# EAGLE schematic snc98_main_cpu (EAGLE 7.7.0)

## Sheet 1 of 3
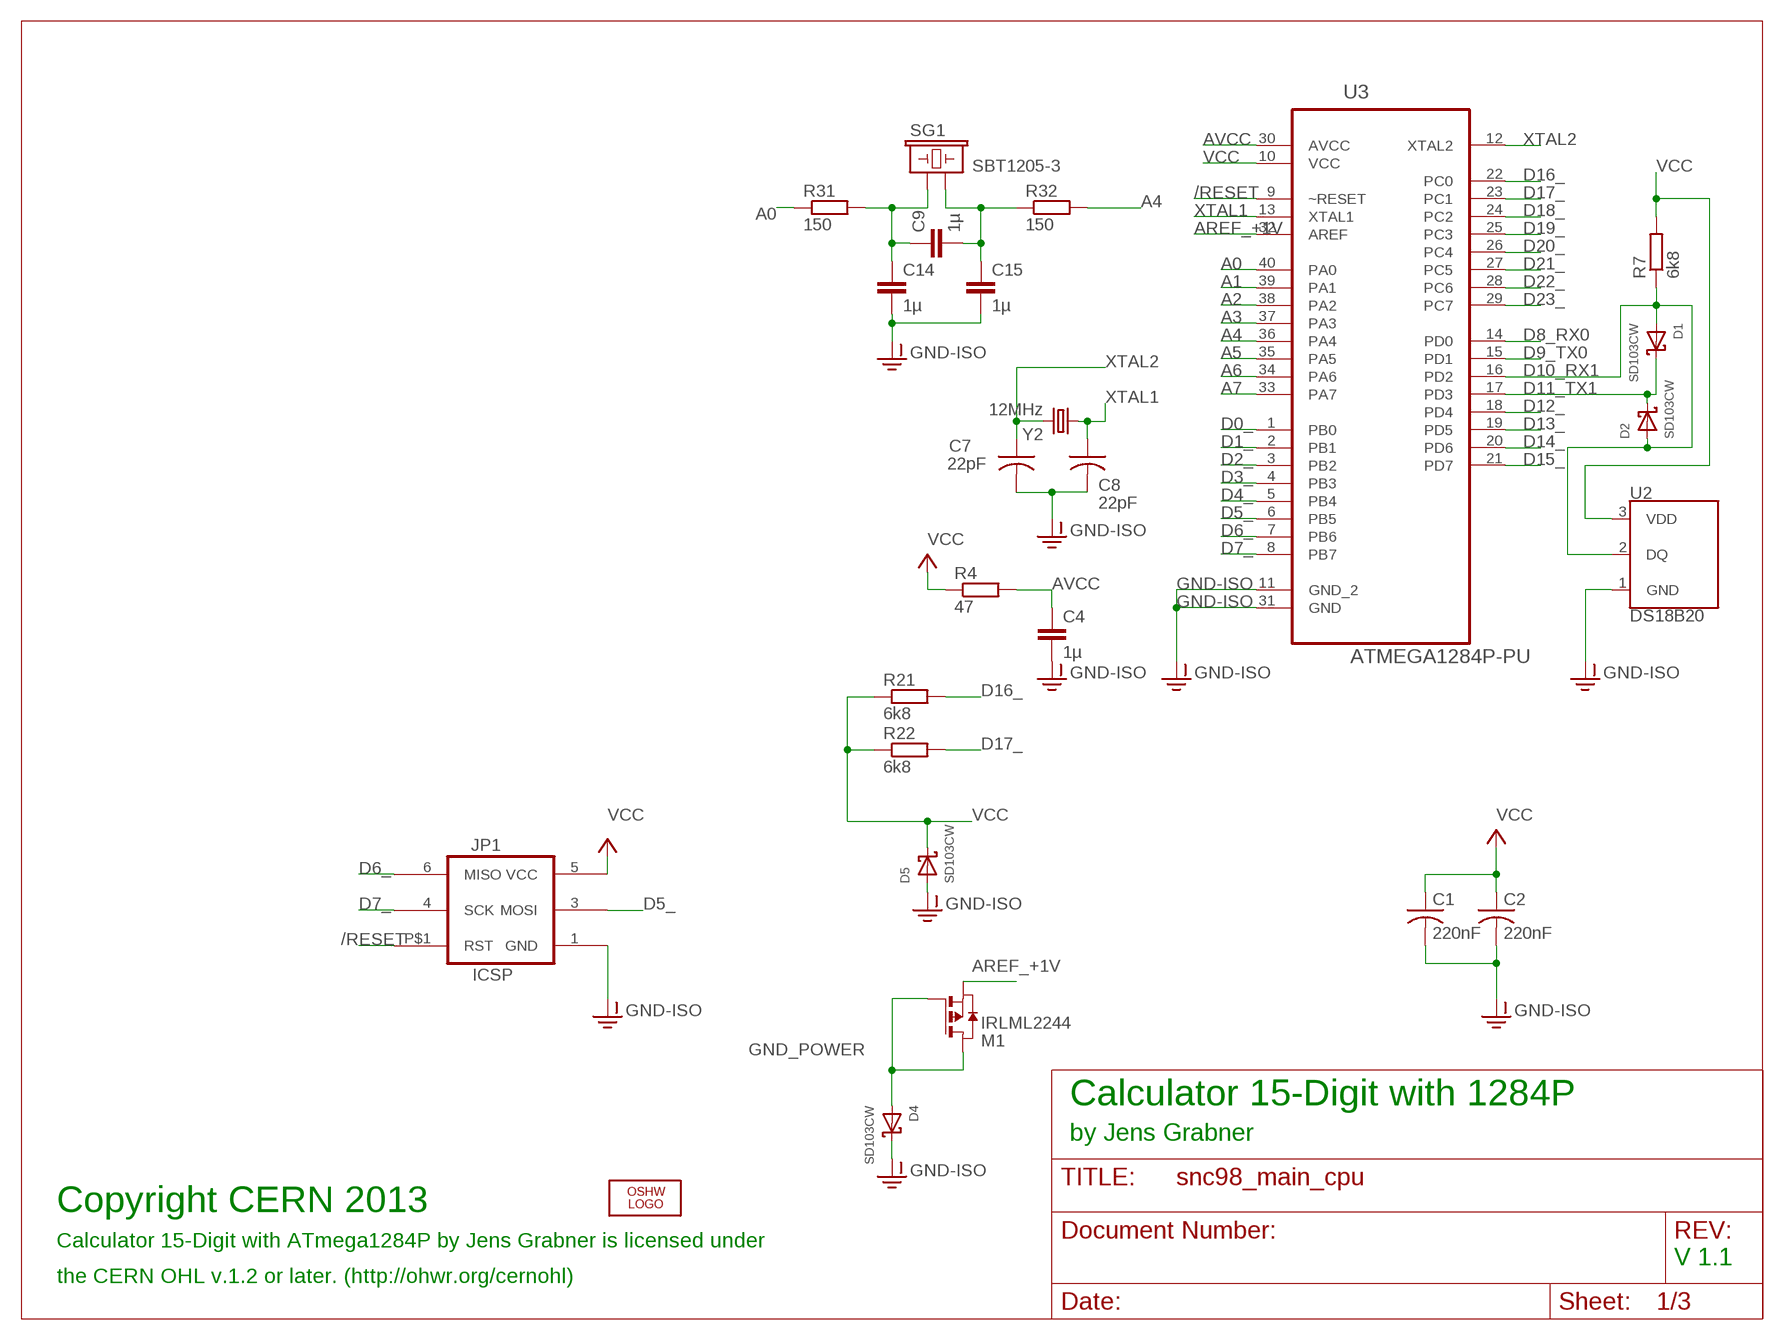
[diagram p0: schematic, sheet 1]

### Parts
C1  220nF  C-USC1206K  [C1206K]
C2  220nF  C-USC1206K  [C1206K]
C4  1µ  C-EUC1206K  [C1206K]
C7  22pF  C-USC0805K  [C0805K]
C8  22pF  C-USC0805K  [C0805K]
C9  1µ  C-EUC1206K  [C1206K]
C14  1µ  C-EUC1206K  [C1206K]
C15  1µ  C-EUC1206K  [C1206K]
D1  SD103CW  DIODESOD-323  [SOD-323]
D2  SD103CW  DIODESOD-123  [SOD-123]
D4  SD103CW  DIODESOD-123F  [SOD-123F]
D5  SD103CW  DIODESOD-123F  [SOD-123F]
JP1  ICSP  AVR_SPI_PRG_6  [2X3_SMD_VERTICAL]
LOGO1  OSHW_LOGO_8MILX0150-NT  [OSHW_8X150_NOTEXT]
M1  IRLML2244  IRLML6402  [SOT-23]
R4  47  R-EU_R1206  [R1206]
R7  6k8  R-EU_R1206  [R1206]
R21  6k8  R-EU_R1206  [R1206]
R22  6k8  R-EU_R1206  [R1206]
R31  150  R-EU_R1206  [R1206]
R32  150  R-EU_R1206  [R1206]
SG1  SBT1205-3  BUZZERNS  [BUZZER-12MM-NS]
U2  DS18B20  [TO-92-AMMO]
U3  ATMEGA1284P-PU  [DIP254P1524X483-40]
Y2  12MHz  CRYSTALHC49UV  [HC49U-V]

### Nets
/RESET: JP1.P$1(RST) U3.9(~RESET) ; also sheet 3
A0: R31.1 U3.40(PA0)
A1: U3.39(PA1) ; also sheet 2
A2: U3.38(PA2) ; also sheet 2
A3: U3.37(PA3) ; also sheet 2
A4: R32.2 U3.36(PA4)
A5: U3.35(PA5) ; also sheet 2
A6: U3.34(PA6) ; also sheet 2
A7: U3.33(PA7) ; also sheet 2
AREF_+1V: M1.2(S) U3.32(AREF) ; also sheet 2,3
AVCC: C4.1 R4.2 U3.30(AVCC)
D0_: U3.1(PB0) ; also sheet 2
D1_: U3.2(PB1) ; also sheet 2
D2_: U3.3(PB2) ; also sheet 2
D3_: U3.4(PB3) ; also sheet 2
D4_: U3.5(PB4) ; also sheet 2
D5_: JP1.3(MOSI) U3.6(PB5)
D6_: JP1.6(MISO) U3.7(PB6) ; also sheet 2
D7_: JP1.4(SCK) U3.8(PB7) ; also sheet 2
D8_RX0: U3.14(PD0) ; also sheet 3
D9_TX0: U3.15(PD1) ; also sheet 3
D10_RX1: D1.A D2.A R7.1 U2.2(DQ) U3.16(PD2)
D11_TX1: D1.C D2.C U3.17(PD3)
D12_: U3.18(PD4) ; also sheet 2
D13_: U3.19(PD5) ; also sheet 2
D14_: U3.20(PD6) ; also sheet 2
D15_: U3.21(PD7) ; also sheet 2
D16_: R21.2 U3.22(PC0)
D17_: R22.2 U3.23(PC1)
D18_: U3.24(PC2) ; also sheet 3
D19_: U3.25(PC3) ; also sheet 2
D20_: U3.26(PC4) ; also sheet 2
D21_: U3.27(PC5) ; also sheet 2
D22_: U3.28(PC6) ; also sheet 2
D23_: U3.29(PC7) ; also sheet 2
GND-ISO: C1.2 C2.2 C4.2 C7.2 C8.2 C14.2 C15.2 D4.C D5.A JP1.1(GND) U2.1(GND) U3.11(GND_2) U3.31(GND) ; also sheet 2,3
GND_POWER: D4.A M1.1(G) M1.3(D)
N$10: C9.2 C15.1 R32.1 SG1.-
N$23: C9.1 C14.1 R31.2 SG1.+
VCC: C1.1 C2.1 D5.C JP1.5(VCC) R4.1 R7.2 R21.1 R22.1 U2.3(VDD) U3.10(VCC) ; also sheet 3
XTAL1: C8.1 U3.13(XTAL1) Y2.1
XTAL2: C7.1 U3.12(XTAL2) Y2.2

### Notes on the sheet
- Calculator 15-Digit with 1284P
- by Jens Grabner
- Copyright CERN 2013
- Calculator 15-Digit with ATmega1284P by Jens Grabner is licensed under
- V 1.1
- the CERN OHL v.1.2 or later. (http://ohwr.org/cernohl)

## Sheet 2 of 3
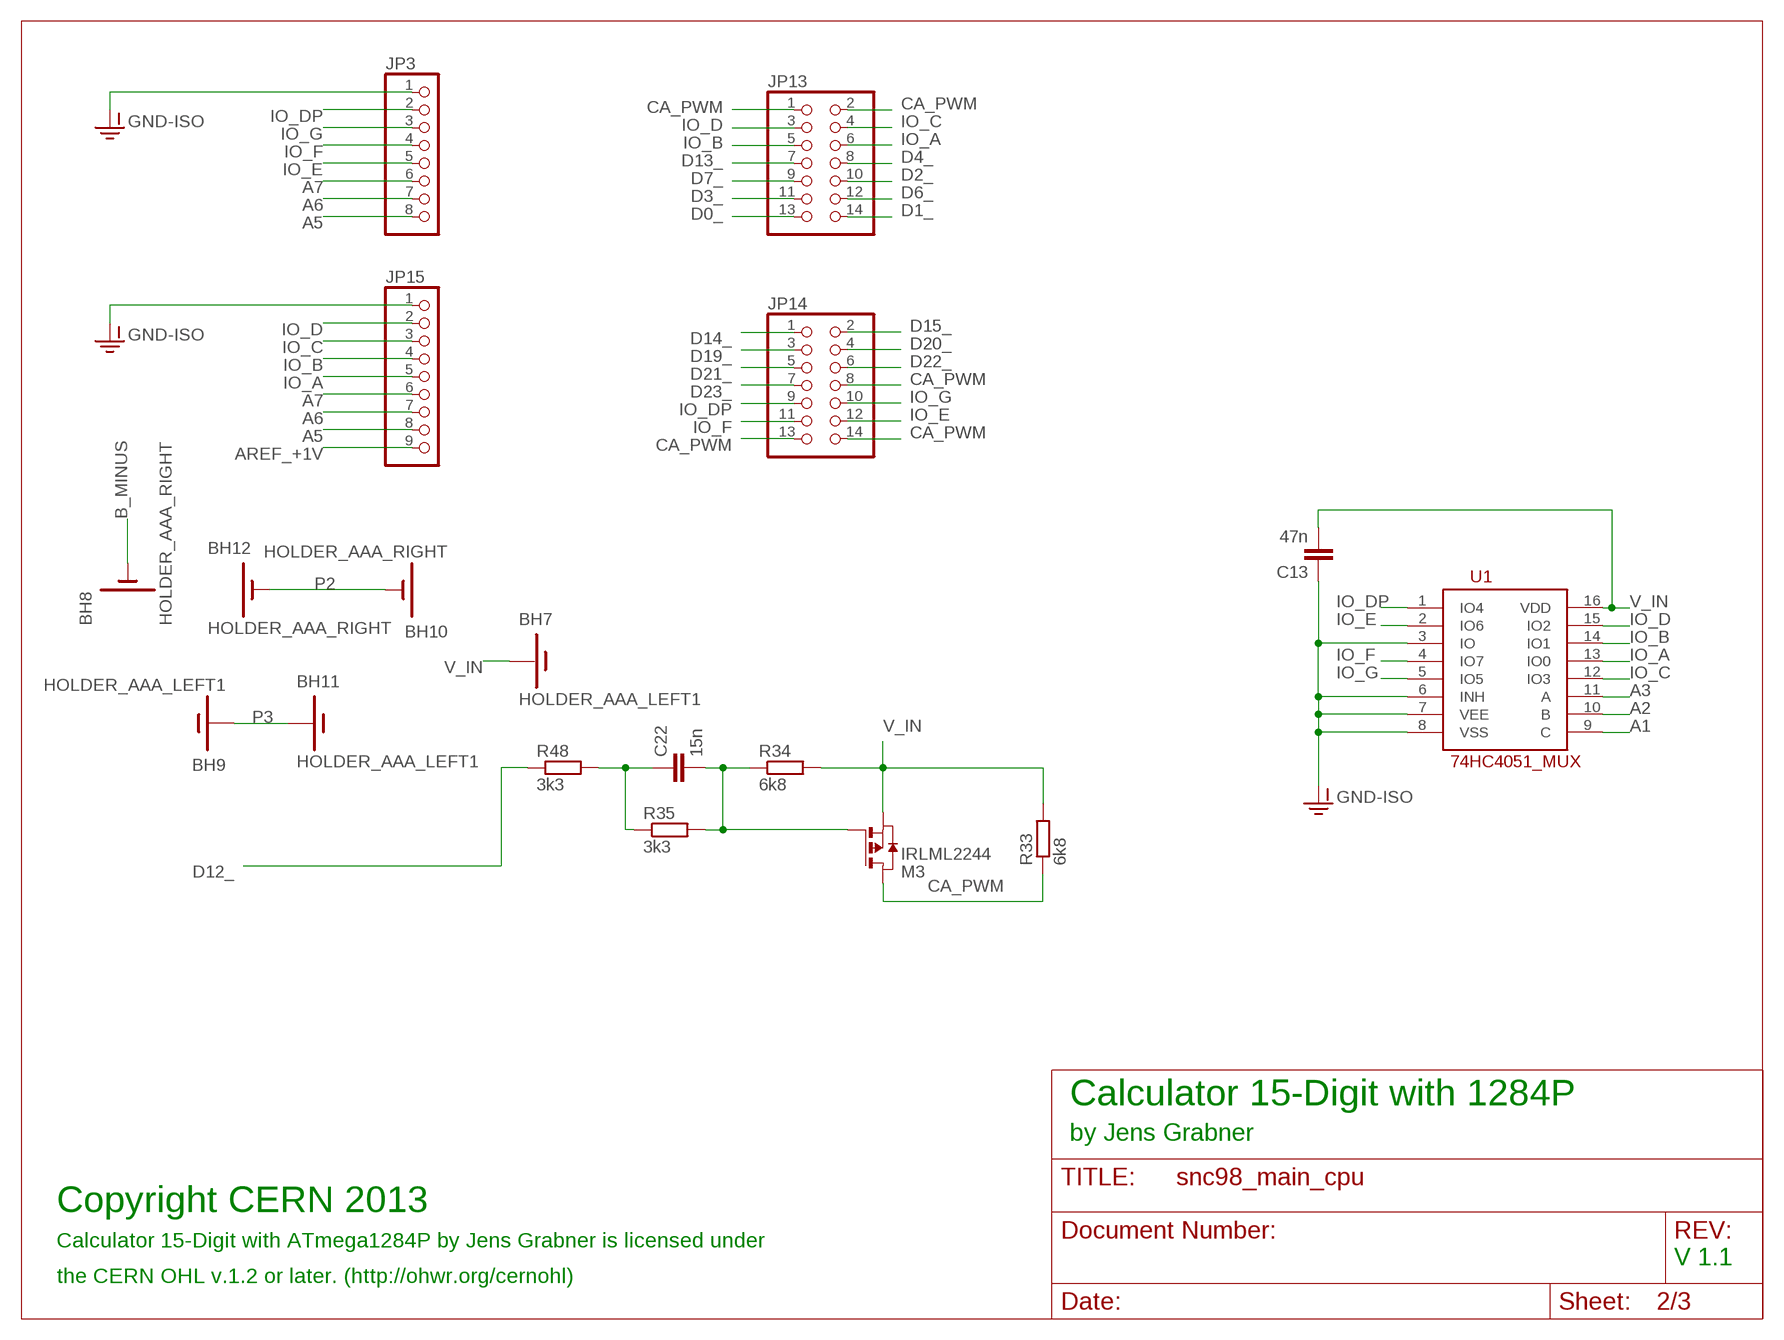
[diagram p1: schematic, sheet 2]

### Parts
BH7  HOLDER_AAA_LEFT1  [BATTERY-AAA-LEFT]
BH8  HOLDER_AAA_RIGHT  [BATTERY-AAA-RIGHT]
BH9  HOLDER_AAA_LEFT1  [BATTERY-AAA-LEFT]
BH10  HOLDER_AAA_RIGHT  [BATTERY-AAA-RIGHT]
BH11  HOLDER_AAA_LEFT1  [BATTERY-AAA-LEFT]
BH12  HOLDER_AAA_RIGHT  [BATTERY-AAA-RIGHT]
C13  47n  C-EUC1206K  [C1206K]
C22  15n  C-EUC1206K  [C1206K]
JP3  PINHD-1X8CLEANBIG  [1X08-CLEANBIG]
JP13  PINHD-2X7  [2X07]
JP14  PINHD-2X7  [2X07]
JP15  PINHD-1X9  [1X09-BIG]
M3  IRLML2244  IRLML6402  [SOT-23]
R33  6k8  R-EU_R1206  [R1206]
R34  6k8  R-EU_R1206  [R1206]
R35  3k3  R-EU_R1206  [R1206]
R48  3k3  R-EU_R1206  [R1206]
U1  74HC4051_MUX  [SO16]

### Nets
A1: U1.9(C) ; also sheet 1
A2: U1.10(B) ; also sheet 1
A3: U1.11(A) ; also sheet 1
A5: JP3.8 JP15.8 ; also sheet 1
A6: JP3.7 JP15.7 ; also sheet 1
A7: JP3.6 JP15.6 ; also sheet 1
A8: C22.1 R35.1 R48.2
AREF_+1V: JP15.9 ; also sheet 1,3
B_MINUS: BH8.M1(-) BH8.M2(-) BH8.M3(-) BH8.M4(-) ; also sheet 3
CA_PWM: JP13.1 JP13.2 JP14.8 JP14.13 JP14.14 M3.3(D) R33.1
D0_: JP13.13 ; also sheet 1
D1_: JP13.14 ; also sheet 1
D2_: JP13.10 ; also sheet 1
D3_: JP13.11 ; also sheet 1
D4_: JP13.8 ; also sheet 1
D6_: JP13.12 ; also sheet 1
D7_: JP13.9 ; also sheet 1
D12_: R48.1 ; also sheet 1
D13_: JP13.7 ; also sheet 1
D14_: JP14.1 ; also sheet 1
D15_: JP14.2 ; also sheet 1
D19_: JP14.3 ; also sheet 1
D20_: JP14.4 ; also sheet 1
D21_: JP14.5 ; also sheet 1
D22_: JP14.6 ; also sheet 1
D23_: JP14.7 ; also sheet 1
GND-ISO: C13.1 JP3.1 JP15.1 U1.3(IO) U1.6(INH) U1.7(VEE) U1.8(VSS) ; also sheet 1,3
IO_A: JP13.6 JP15.5 U1.13(IO0)
IO_B: JP13.5 JP15.4 U1.14(IO1)
IO_C: JP13.4 JP15.3 U1.12(IO3)
IO_D: JP13.3 JP15.2 U1.15(IO2)
IO_DP: JP3.2 JP14.9 U1.1(IO4)
IO_E: JP3.5 JP14.12 U1.2(IO6)
IO_F: JP3.4 JP14.11 U1.4(IO7)
IO_G: JP3.3 JP14.10 U1.5(IO5)
N$1: C22.2 M3.1(G) R34.1 R35.2
P2: BH10.M1(-) BH10.M2(-) BH10.M3(-) BH10.M4(-) BH12.M1(-) BH12.M2(-) BH12.M3(-) BH12.M4(-)
P3: BH9.P1(+) BH9.P2(+) BH9.P3(+) BH9.P4(+) BH11.P1(+) BH11.P2(+) BH11.P3(+) BH11.P4(+)
V_IN: BH7.P1(+) BH7.P2(+) BH7.P3(+) BH7.P4(+) C13.2 M3.2(S) R33.2 R34.2 U1.16(VDD) ; also sheet 3

### Notes on the sheet
- Calculator 15-Digit with 1284P
- by Jens Grabner
- Copyright CERN 2013
- Calculator 15-Digit with ATmega1284P by Jens Grabner is licensed under
- V 1.1
- the CERN OHL v.1.2 or later. (http://ohwr.org/cernohl)

## Sheet 3 of 3
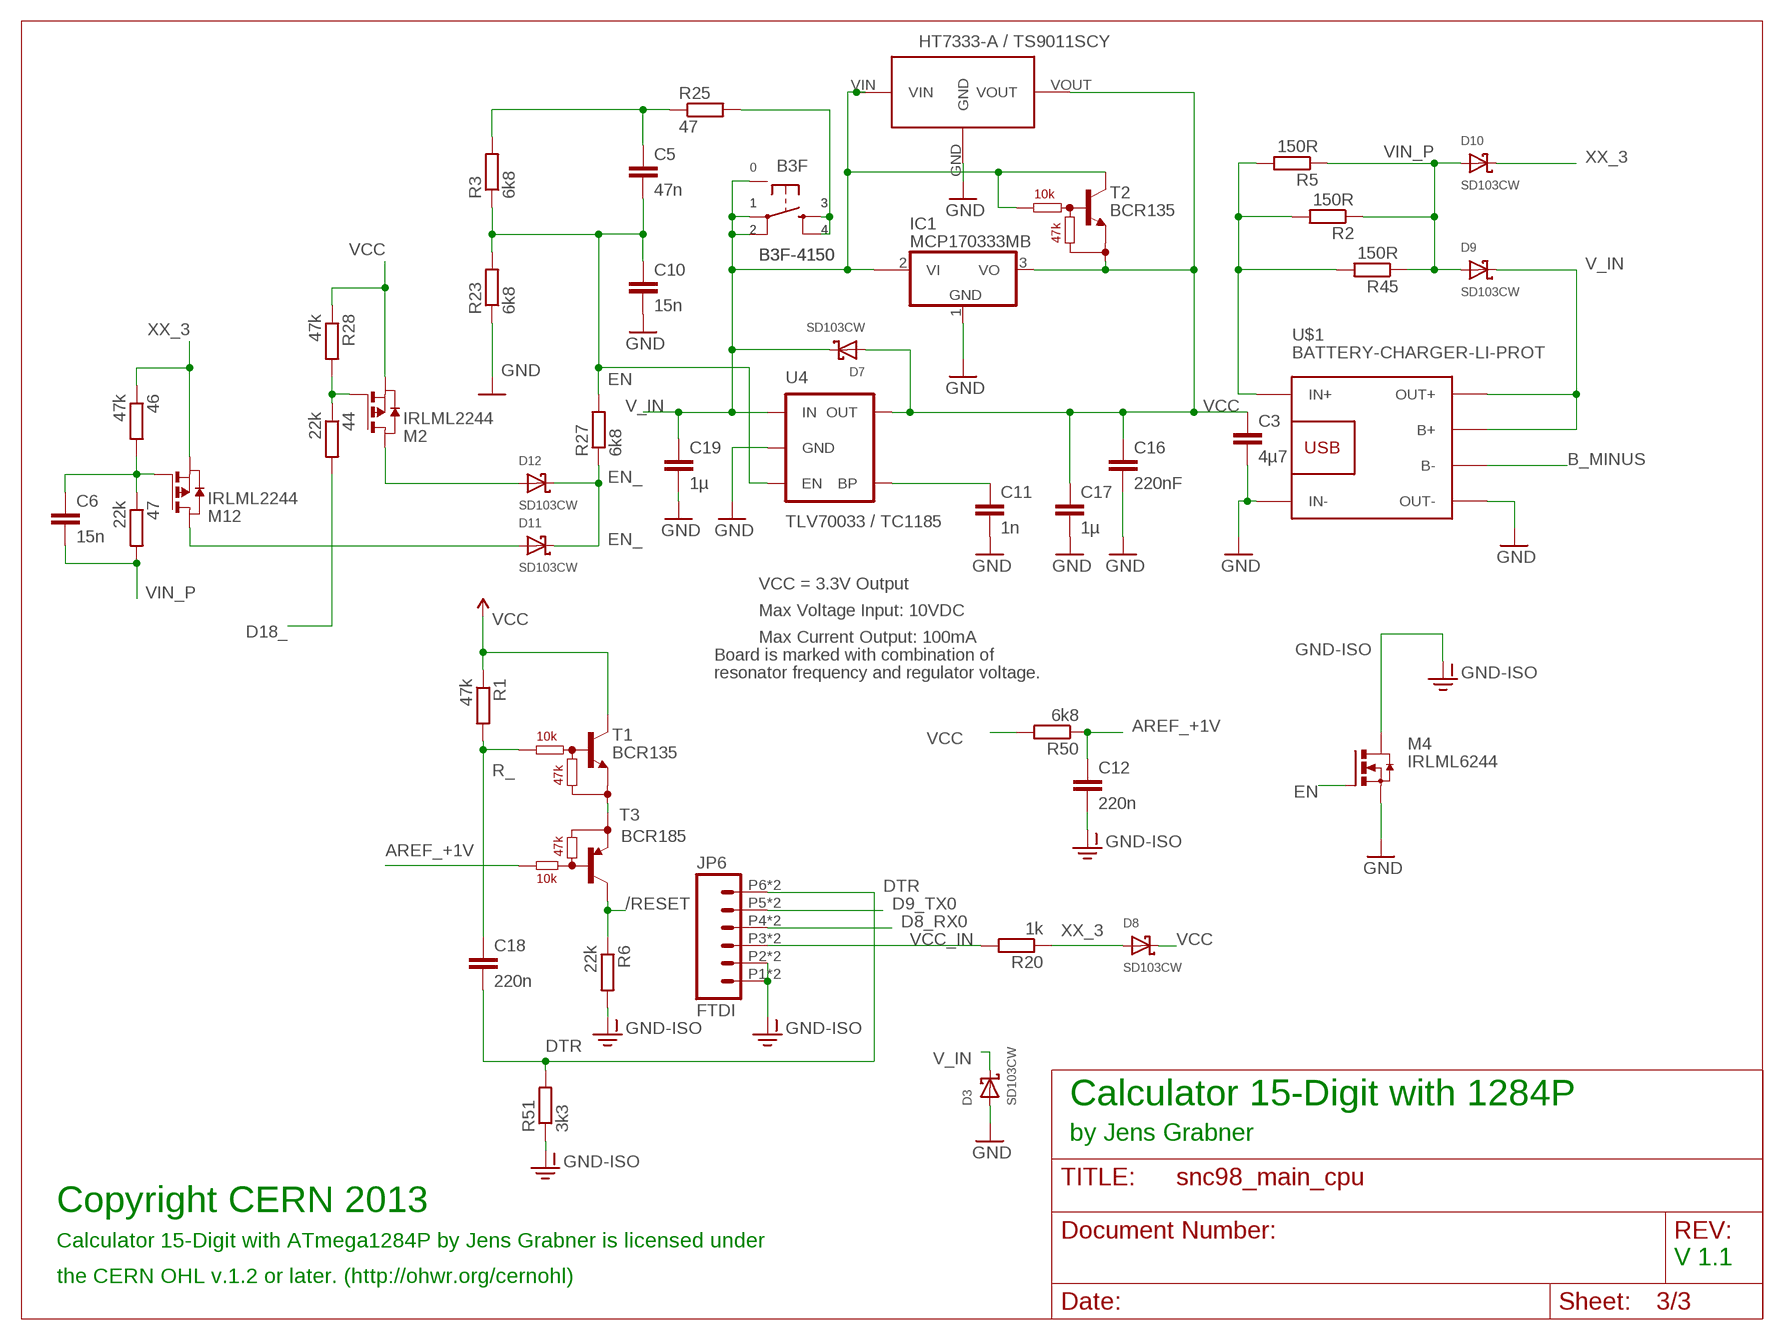
[diagram p2: schematic, sheet 3]

### Parts
44  22k  R-EU_R1206  [R1206]
46  47k  R-EU_R1206  [R1206]
47  22k  R-EU_R1206  [R1206]
C3  4µ7  C-EUC1206K  [C1206K]
C5  47n  C-EUC1206K  [C1206K]
C6  15n  C-EUC1206K  [C1206K]
C10  15n  C-EUC1206K  [C1206K]
C11  1n  CAP0805  [0805]
C12  220n  CAP0805  [0805]
C16  220nF  CAP0805  [0805]
C17  1µ  C-EUC1206K  [C1206K]
C18  220n  C-EUC1206K  [C1206K]
C19  1µ  C-EUC1206K  [C1206K]
D3  SD103CW  DIODESOD-123F  [SOD-123F]
D7  SD103CW  DIODESOD-123F  [SOD-123F]
D8  SD103CW  DIODESOD-123F  [SOD-123F]
D9  SD103CW  DIODESOD-123F  [SOD-123F]
D10  SD103CW  DIODESOD-123F  [SOD-123F]
D11  SD103CW  DIODESOD-123F  [SOD-123F]
D12  SD103CW  DIODESOD-123F  [SOD-123F]
IC1  MCP170333MB  [SOT89]
JP6  FTDI  M06LOCK  [1X06_LOCK]
M2  IRLML2244  IRLML6402  [SOT-23]
M4  IRLML6244  IRLML2502M  [SOT-23]
M12  IRLML2244  IRLML6402  [SOT-23]
R1  47k  R-EU_R1206  [R1206]
R2  150R  R-EU_0204/5  [0204/5]
R3  6k8  R-EU_R1206  [R1206]
R5  150R  R-EU_0207/10  [0207/10]
R6  22k  R-EU_R1206  [R1206]
R20  1k  R-EU_R1206  [R1206]
R23  6k8  R-EU_R1206  [R1206]
R25  47  R-EU_R1206  [R1206]
R27  6k8  R-EU_R1206  [R1206]
R28  47k  R-EU_R1206  [R1206]
R45  150R  R-EU_R1206  [R1206]
R50  6k8  R-EU_R1206  [R1206]
R51  3k3  R-EU_R1206  [R1206]
S3  B3F-4150  TACTILE_SWITCHTACTILE_SWITCH_PTH-12MM  [TACTILE-PTH-12MM]
T1  BCR135  [SOT23-BEC]
T2  BCR135  [SOT23-BEC]
T3  BCR185  [SOT23-R_INFINEON]
U4  TLV70033 / TC1185  V_REG_LDOSMD  [SOT23-5]
U$1  BATTERY-CHARGER-LI-PROT  [BATTERY-CHARGER-LI-PROT]
U$3  HT7333 / TS9011SCY  HT7333  [SOT89]

### Nets
/RESET: R6.1 T3.C ; also sheet 1
A9: C5.1 R3.2 R25.1
AREF_+1V: C12.3 R50.1 T3.B ; also sheet 1,2
B_MINUS: U$1.B- ; also sheet 2
CA_PWM1: D12.A M2.3(D)
CA_PWM2: D11.A M12.3(D)
D8_RX0: JP6.P4 JP6.P4A ; also sheet 1
D9_TX0: JP6.P5 JP6.P5A ; also sheet 1
D18_: 44.2 ; also sheet 1
DTR: C18.2 JP6.P6 JP6.P6A R51.2
EN: C5.2 C10.1 M4.1(G) R3.1 R23.2 R27.2 U4.3(EN)
EN_: D11.C D12.C R27.1
GND: C3.2 C10.2 C11.4 C16.4 C17.2 C19.2 D3.A IC1.1(GND) M4.2(S) R23.1 U4.2(GND) U$1.IN- U$1.OUT- U$3.GND
GND-ISO: C12.4 JP6.P1 JP6.P1A JP6.P2 JP6.P2A M4.3(D) R6.2 R51.1 ; also sheet 1,2
N$2: T1.E T3.E
N$3: C11.3 U4.4(BP)
N$6: R25.2 S3.P$3 S3.P$4 S3.P$13 S3.P$14 S3.P$23 S3.P$24
N$8: 44.1 M2.1(G) R28.2
N$9: 46.2 47.1 C6.1 M12.1(G)
N$13: R2.2 R5.2 R45.2 U$1.IN+
R_: C18.1 R1.2 T1.B
V_IN: C19.1 D3.C D7.C D9.C IC1.2@1(VI1) S3.P$1 S3.P$2 S3.P$11 S3.P$12 S3.P$15 S3.P$21 S3.P$22 T2.B T2.C U4.1(IN) U$1.B+ U$1.OUT+ U$3.VIN ; also sheet 2
VCC: C3.1 C16.3 C17.1 D7.A D8.C IC1.3(VO) M2.2(S) R1.1 R28.1 R50.2 T1.C T2.E U4.5(OUT) U$3.VOUT ; also sheet 1
VCC_IN: JP6.P3 JP6.P3A R20.2
VIN_P: 47.2 C6.2 D9.A D10.A R2.1 R5.1 R45.1
XX_3: 46.1 D8.A D10.C M12.2(S) R20.1
Unconnected: IC1.2(VI)

### Notes on the sheet
- HT7333-A / TS9011SCY
- VCC = 3.3V Output
- Max Voltage Input: 10VDC
- Max Current Output: 100mA
- Board is marked with combination of
- resonator frequency and regulator voltage.
- Calculator 15-Digit with 1284P
- by Jens Grabner
- Copyright CERN 2013
- Calculator 15-Digit with ATmega1284P by Jens Grabner is licensed under
- V 1.1
- the CERN OHL v.1.2 or later. (http://ohwr.org/cernohl)

## Library data of the parts
44 47 R6 = rcl:R-EU_: RESISTOR, European symbol; OC_FARNELL: unknown; TME_EU: CRCW080522K0FKTABC
46 R1 R28 = rcl:R-EU_: RESISTOR, European symbol; OC_FARNELL: unknown; TME_EU: CRCW080547K0FKTABC
BH7 BH9 BH11 = SparkFun-Electromechanical:HOLDER_AAA_LEFT; OC_FARNELL: unknown; TME_EU: BC-0401
BH8 BH10 BH12 = SparkFun-Electromechanical:HOLDER_AAA_RIGHT; OC_FARNELL: unknown
C1 C2 = _jc:C-US: CAPACITOR, American symbol; OC_FARNELL: unknown
C3 C4 C9 C14 C15 C17 C19 = rcl:C-EU: CAPACITOR, European symbol; OC_FARNELL: unknown; TME_EU: GRM31MR71C105KA
C5 C13 = rcl:C-EU: CAPACITOR, European symbol; OC_FARNELL: unknown; TME_EU: CC0805KRX7R9473
C6 C10 C22 = rcl:C-EU: CAPACITOR, European symbol; OC_FARNELL: unknown; TME_EU: CC0805KRX7R9153
C7 C8 = _jc:C-US: CAPACITOR, American symbol; OC_FARNELL: unknown; TME_EU: CL21C220JBANNNC
C11 C12 C16 = SparkFun:CAP: Capacitor Standard 0603 ceramic capacitor, and 0.1" leaded capacitor.; OC_FARNELL: unknown; TME_EU: CC0805KPX7R7224
C18 = rcl:C-EU: CAPACITOR, European symbol; OC_FARNELL: unknown; TME_EU: CC0805KPX7R7224
D1-D5 D7-D12 = BaseApp:DIODE; MF: MULTICOMP; MPN: SD103CW-7-F; OC_FARNELL: 2306221
IC1 = linear:MCP1703*: 250 mA, 16V, Low Quiescent Current LDO Regulator Source: http://ww1.microchip.com/downloads/en/DeviceDoc/22049b.pdf; OC_FARNELL: unknown
JP1 = _jc:AVR_SPI_PRG_6: AVR ISP 6 Pin This is the reduced ISP connector for AVR programming. Common on Arduino. This footprint will take up less PCB space and can be used with a 10-pin to 6-pin adapter such as SKU: BOB-08508; OC_FARNELL: unknown
JP3 = adafruit:PINHD-1X8: PIN HEADER; OC_FARNELL: unknown
JP6 = SparkFun:M06: Header 6 Standard 6-pin 0.1" header. Use with straight break away headers (SKU : PRT-00116), right angle break away headers (PRT-00553), swiss pins (PRT-00743), machine pins (PRT-00117), and female headers (PRT-00115). Molex polarized connector foot print use with SKU : PRT-08094 with associated crimp pins and housings. NOTES ON THE VARIANTS LOCK and LOCK_LONGPADS... This footprint was designed to help hold the alignment of a through-hole component (i.e. 6-pin header) while soldering it into place. You may notice that each hole has been shifted either up or down by 0.005 of an inch from it's more standard position (which is a perfectly straight line). This slight alteration caused the pins (the squares in the middle) to touch the edges of the holes. Because they are alternating, it causes a "brace" to hold the component in place. 0.005 has proven to be the perfect amount of "off-center" position when using our standard breakaway headers. Although looks a little odd when you look at the bare footprint, once you have a header in there, the alteration is very hard to notice. Also, if you push a header all the way into place, it is covered up entirely on the bottom side. This idea of altering the position of holes to aid alignment will be further integrated into the Sparkfun Library for other footprints. It can help hold any component with 3 or more connection pins.; OC_FARNELL: unknown
JP13 JP14 = pinhead:PINHD-2X7: PIN HEADER; OC_FARNELL: unknown; TME_EU: ZL231-14PG
JP15 = adafruit:PINHD-1X9: Pin header 1x10 0.1" spacing With round pins; OC_FARNELL: unknown
LOGO1 = ohw-logo:OSHW_LOGO_8MIL; OC_FARNELL: unknown
M1-M3 M12 = IRLML6402:IRLML6402; MF: INFINEON; MPN: IRLML2244TRPBF; OC_FARNELL: 2468051; TME_EU: DMG2305UX-7
M4 = transistor-power:IRLML2502; MF: INFINEON; MPN: IRLML6244TRPBF; OC_FARNELL: 1864517; TME_EU: DMG2302U-7
R2 R5 R20 R25 R33 R45 = rcl:R-EU_: RESISTOR, European symbol; OC_FARNELL: unknown
R3 R7 R21-R23 R27 R34 R50 = rcl:R-EU_: RESISTOR, European symbol; OC_FARNELL: unknown; TME_EU: RC0805FR-076K8
R4 = rcl:R-EU_: RESISTOR, European symbol; OC_FARNELL: unknown; TME_EU: WF08P-100R-5%
R31 R32 = rcl:R-EU_: RESISTOR, European symbol; OC_FARNELL: unknown; TME_EU: CRCW0805150RJNTABC
R35 R48 R51 = rcl:R-EU_: RESISTOR, European symbol; OC_FARNELL: unknown; TME_EU: RC0805FR-073K3
S3 = SmartPrj:TACTILE_SWITCH: Momentary Switch Button commonly used for reset or general input.; MF: OMRON; MPN: B3F4150; OC_FARNELL: 1960976; TME_EU: B3F-4050
SG1 = SparkFun-Electromechanical:BUZZER: Buzzer 12mm Spark Fun Electronics SKU : Comp-Buzzer; OC_FARNELL: unknown
T1 T2 = digital-transistors:BCR135: NPN Silicon Digital Transistor 50V 0,1A 0,2W; MF: INFINEON; MPN: BCR135E6327HTSA1; OC_FARNELL: 2443491RL; TME_EU: MUN2214T1G
T3 = digital-transistors-1(1):BCR185: PNP Silicon Digital Transistor 50V 0,1A 0,2W; MF: ROHM; MPN: DTA114YKAT146; OC_FARNELL: 1680186; TME_EU: BCR185E6327
U1 = SparkFun-AnalogIC:74HC4051_MUX: 8:1 analog mux; OC_FARNELL: unknown; TME_EU: 4HC4051D.652
U2 = SparkFun-Sensors:DS18B20: Dallas/Maxim DS18B20 1-Wire Temperature Sensor The DS18B20 reports degrees C with 9 to 12-bit precision, -55C to 125C (+/-0.5C). Each sensor has a unique 64-Bit Serial number etched into it - allows for a huge number of sensors to be used on one data bus. Datasheet <http://datasheets.maximintegrated.com/en/ds/DS18B20.pdf> SparkFun Products One Wire Digital Temperature Sensor - DS18B20 <https://www.sparkfun.com/products/245> (SEN-00245); OC_FARNELL: unknown; STORE_ID: SEN-00245
U3 = Atmel_By_element14_Batch_1-00:ATMEGA1284P-PU: 8-bit Microcontroller with In-System Programmable Flash; MF: MICROCHIP; MPN: ATMEGA1284P-PU; OC_FARNELL: 1715481; OC_NEWARK: 15R0264; PACKAGE: PDIP-40; SUPPLIER: Atmel
U4 = SparkFun:V_REG_LDO: Voltage Regulator LDO Standard 150mA LDO voltage regulator in SOT-23 layout. Micrel part MIC5205. BP (by-pass) pin is used to lower output noise with 470pF cap.; OC_FARNELL: unknown
U$1 = diy-modules:BATTERY-CHARGER-LI-PROT: Lithium Battery 5V Charger with protection circuit More details available here: http://www.instructables.com/id/DIY-Lithium-ion-Battery-Charger/step4/TP4056-based-lithium-ion-battery-charger-module/ Click here to find device on ebay.com <http://www.ebay.com/sch/tp4056+charger+usb+protection>; OC_FARNELL: unknown
U$3 = HT7333_SOT89:HT7333; OC_FARNELL: unknown; TME_EU: TS9011SCY
Y2 = SparkFun-FreqCtrl:CRYSTAL: Various standard crystals. Proven footprints. Spark Fun Electronics SKU : COM-00534; OC_FARNELL: unknown

## Net classes
0 default: clearance 0.205 mm
1 vcc: width 0.254 mm